# Altium project Buck_Boost_Converter.PrjPcb
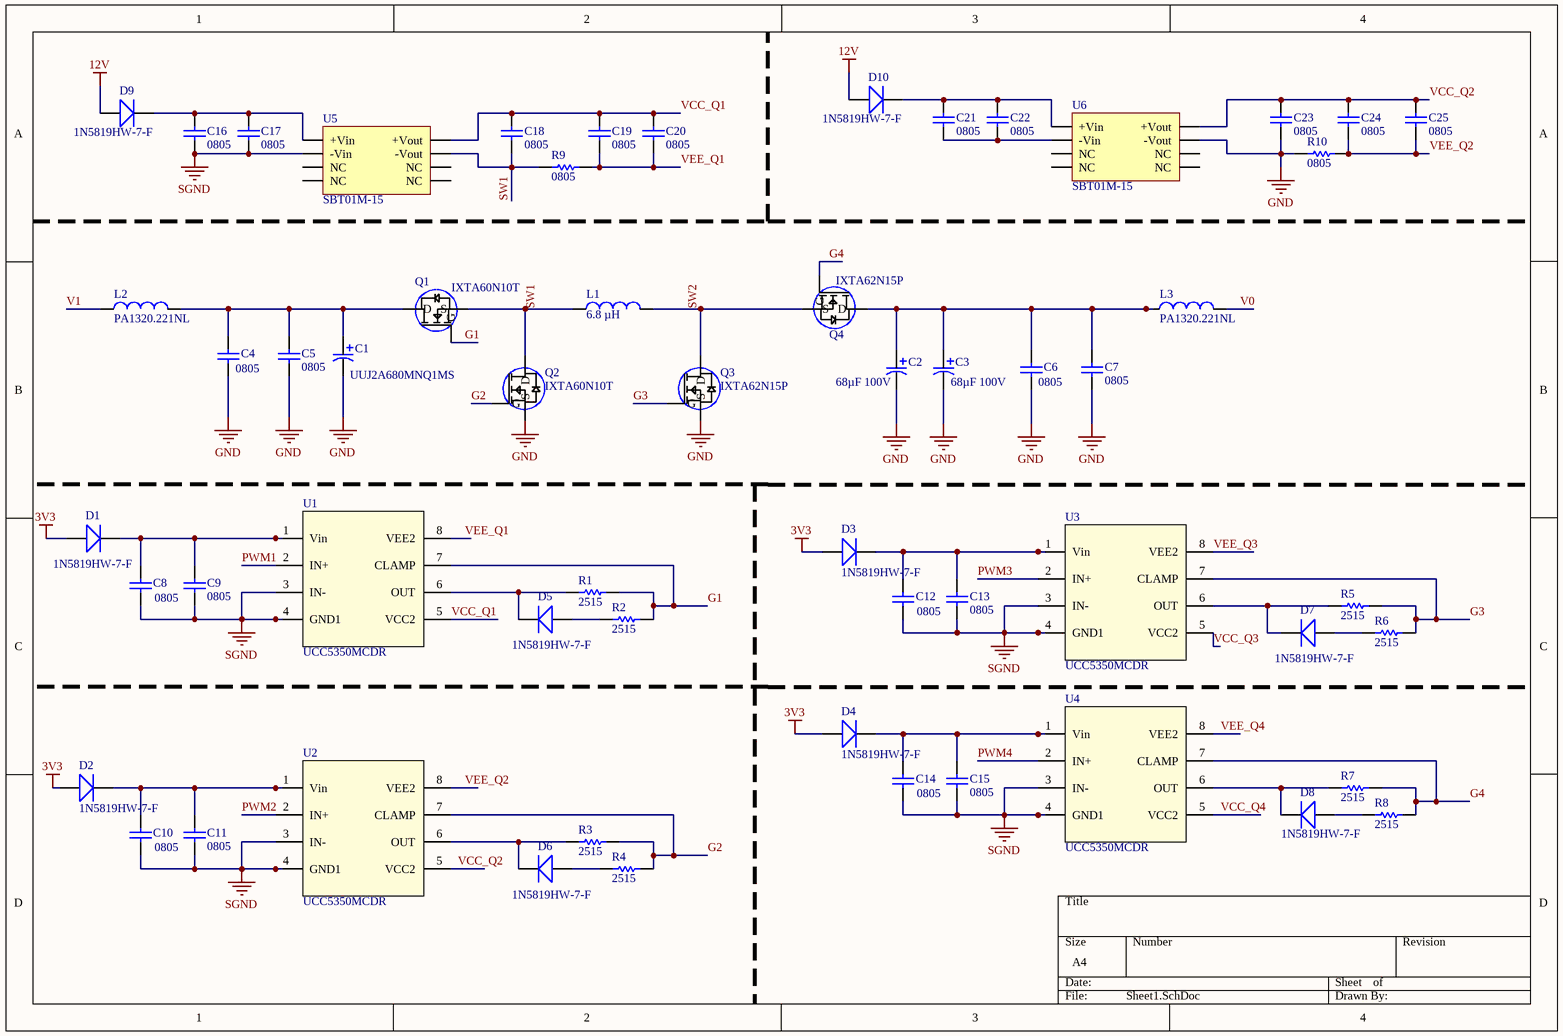
[diagram p0: Sheet1.SchDoc]
2 sheets, 100 parts. Net scope: global (net labels, ports and power ports of the same name join across sheets).
Board file: PCB1.PcbDoc
Sheets:
  Sheet1.SchDoc
  Sheet2.SchDoc

## Sheet Sheet1.SchDoc
size A4; SheetNumber: 1; SheetTotal: 2

### Parts
C1  UUJ2A680MNQ1MS  [UUJ2A680MNQ1MS]
C2  68µF 100V  [UUJ2A680MNQ1MS]
C3  68µF 100V  [UUJ2A680MNQ1MS]
C4  0805  [0805 CAPACITOR]
C5  0805  [0805 CAPACITOR]
C6  0805  [0805 CAPACITOR]
C7  0805  [0805 CAPACITOR]
C8  0805  [0805 CAPACITOR]
C9  0805  [0805 CAPACITOR]
C10  0805  [0805 CAPACITOR]
C11  0805  [0805 CAPACITOR]
C12  0805  [0805 CAPACITOR]
C13  0805  [0805 CAPACITOR]
C14  0805  [0805 CAPACITOR]
C15  0805  [0805 CAPACITOR]
C16  0805  [0805 CAPACITOR]
C17  0805  [0805 CAPACITOR]
C18  0805  [0805 CAPACITOR]
C19  0805  [0805 CAPACITOR]
C20  0805  [0805 CAPACITOR]
C21  0805  [0805 CAPACITOR]
C22  0805  [0805 CAPACITOR]
C23  0805  [0805 CAPACITOR]
C24  0805  [0805 CAPACITOR]
C25  0805  [0805 CAPACITOR]
D1  1N5819HW-7-F  [1N5819HW-7-F_DIO-M]
D2  1N5819HW-7-F  [1N5819HW-7-F_DIO-M]
D3  1N5819HW-7-F  [1N5819HW-7-F_DIO-M]
D4  1N5819HW-7-F  [1N5819HW-7-F_DIO-M]
D5  1N5819HW-7-F  [1N5819HW-7-F_DIO-M]
D6  1N5819HW-7-F  [1N5819HW-7-F_DIO-M]
D7  1N5819HW-7-F  [1N5819HW-7-F_DIO-M]
D8  1N5819HW-7-F  [1N5819HW-7-F_DIO-M]
D9  1N5819HW-7-F  [1N5819HW-7-F_DIO-M]
D10  1N5819HW-7-F  [1N5819HW-7-F_DIO-M]
L1  6.8 µH  [MPX1D2213L6R8]
L2  PA1320.221NL  [PA1320.221NL]
L3  PA1320.221NL  [PA1320.221NL]
Q1  IXTA60N10T  [IXTA62N15P]
Q2  IXTA60N10T  [IXTA62N15P]
Q3  IXTA62N15P  [IXTA62N15P]
Q4  IXTA62N15P  [IXTA62N15P]
R1  2515  [2512 RESISTOR]
R2  2515  [2512 RESISTOR]
R3  2515  [2512 RESISTOR]
R4  2515  [2512 RESISTOR]
R5  2515  [2512 RESISTOR]
R6  2515  [2512 RESISTOR]
R7  2515  [2512 RESISTOR]
R8  2515  [2512 RESISTOR]
R9  0805  [0805 RESISTOR]
R10  0805  [0805 RESISTOR]
U1  UCC5350MCDR  [UCC5350MCDR]
U2  UCC5350MCDR  [UCC5350MCDR]
U3  UCC5350MCDR  [UCC5350MCDR]
U4  UCC5350MCDR  [UCC5350MCDR]
U5  SBT01M-15  [SBT01M-15]
U6  SBT01M-15  [SBT01M-15]

### Nets
3V3: D1.1 D2.1 D3.1 D4.1
12V: D9.1 D10.1
GND: C1.2 C2.2 C3.2 C4.2 C5.1 C6.2 C7.1 C23.1 Q2.3(S) Q3.3(S) R10.1 U6.4(-Vout)
SGND: C8.1 C9.1 C10.1 C11.1 C12.1 C13.1 C14.1 C15.1 C16.2 C17.1 U1.3(IN-) U1.4(GND1) U2.3(IN-) U2.4(GND1) U3.3(IN-) U3.4(GND1) U4.3(IN-) U4.4(GND1) U5.1(-Vin)
G1: Q1.1(G) R1.2 R2.2 U1.7(CLAMP)
G2: Q2.1(G) R3.2 R4.2 U2.7(CLAMP)
G3: Q3.1(G) R5.2 R6.2 U3.7(CLAMP)
G4: Q4.1(G) R7.2 R8.2 U4.7(CLAMP)
PWM1: U1.2(IN+)
PWM2: U2.2(IN+)
PWM3: U3.2(IN+)
PWM4: U4.2(IN+)
SW1: C18.1 L1.1 Q1.3(S) Q2.2(D) R9.1 U5.4(-Vout)
SW2: L1.2 Q3.2(D) Q4.3(S)
V0: L3.2
V1: L2.1
VCC_Q1: C18.2 C19.2 C20.2 U1.5(VCC2) U5.5(+Vout)
VCC_Q2: C23.2 C24.2 C25.2 U2.5(VCC2) U6.5(+Vout)
VCC_Q3: U3.5(VCC2)
VCC_Q4: U4.5(VCC2)
VEE_Q1: C19.1 C20.1 R9.2 U1.8(VEE2)
VEE_Q2: C24.1 C25.1 R10.2 U2.8(VEE2)
VEE_Q3: U3.8(VEE2)
VEE_Q4: U4.8(VEE2)
NetC1_1: C1.1 C4.1 C5.2 L2.2 Q1.2(D)
NetC2_1: C2.1 C3.1 C6.1 C7.2 L3.1 Q4.2(D)
NetC8_2: C8.2 C9.2 D1.2 U1.1(Vin)
NetC10_2: C10.2 C11.2 D2.2 U2.1(Vin)
NetC12_2: C12.2 C13.2 D3.2 U3.1(Vin)
NetC14_2: C14.2 C15.2 D4.2 U4.1(Vin)
NetC16_1: C16.1 C17.2 D9.2 U5.2(+Vin)
NetC21_1: C21.1 C22.2 D10.2 U6.2(+Vin)
NetC21_2: C21.2 C22.1 U6.1(-Vin)
NetD5_1: D5.1 R2.1
NetD5_2: D5.2 R1.1 U1.6(OUT)
NetD6_1: D6.1 R4.1
NetD6_2: D6.2 R3.1 U2.6(OUT)
NetD7_1: D7.1 R6.1
NetD7_2: D7.2 R5.1 U3.6(OUT)
NetD8_1: D8.1 R8.1
NetD8_2: D8.2 R7.1 U4.6(OUT)

Not connected (* = marked no-connect by the designer): U5 3(NC) 6(NC) 7(NC) 8(NC); U6 3(NC) 6(NC) 7(NC) 8(NC)

### Library data of the parts
C1-C3 = UUJ2A680MNQ1MS: 68µF 100V Aluminum Electrolytic Capacitors
C4 C6 = 0805CAP: 1UF 100V CAP CER  X7S 0805
C5 C7 = 0805CAP_1: 0.1UF 100V CAP CER X5R 0402
C8-C25 = 0805 CAPACITANCE: 4.7UF 100V CAP CER  X7S 0805
D1-D10 = 1N5819HW-7-F: 40V 1A DIODE SCHOTTKY
L1 = 6.8 µH Shielded Wirewound Inductor: 6.8UH 39A 3.3 MOHM SMD
Q1 Q2 = IXTA60N10T: N-Channel 100 V 60A (Tc) 176W (Tc) Surface Mount TO-263AA
Q3 Q4 = IXTA62N15P: N-Channel 150 V 62A (Tc) 350W (Tc) Surface Mount TO-263AA
R1-R8 = 2515 RESISTOR: 10 OHM RES SMD 10 OHM 5% 1W 2512
R9 R10 = 0805 RESISTOR: 1K OHM 16V
U1-U4 = UCC5350MCDR: No Description Available

## Sheet Sheet2.SchDoc
size A4; SheetNumber: 2; SheetTotal: 2
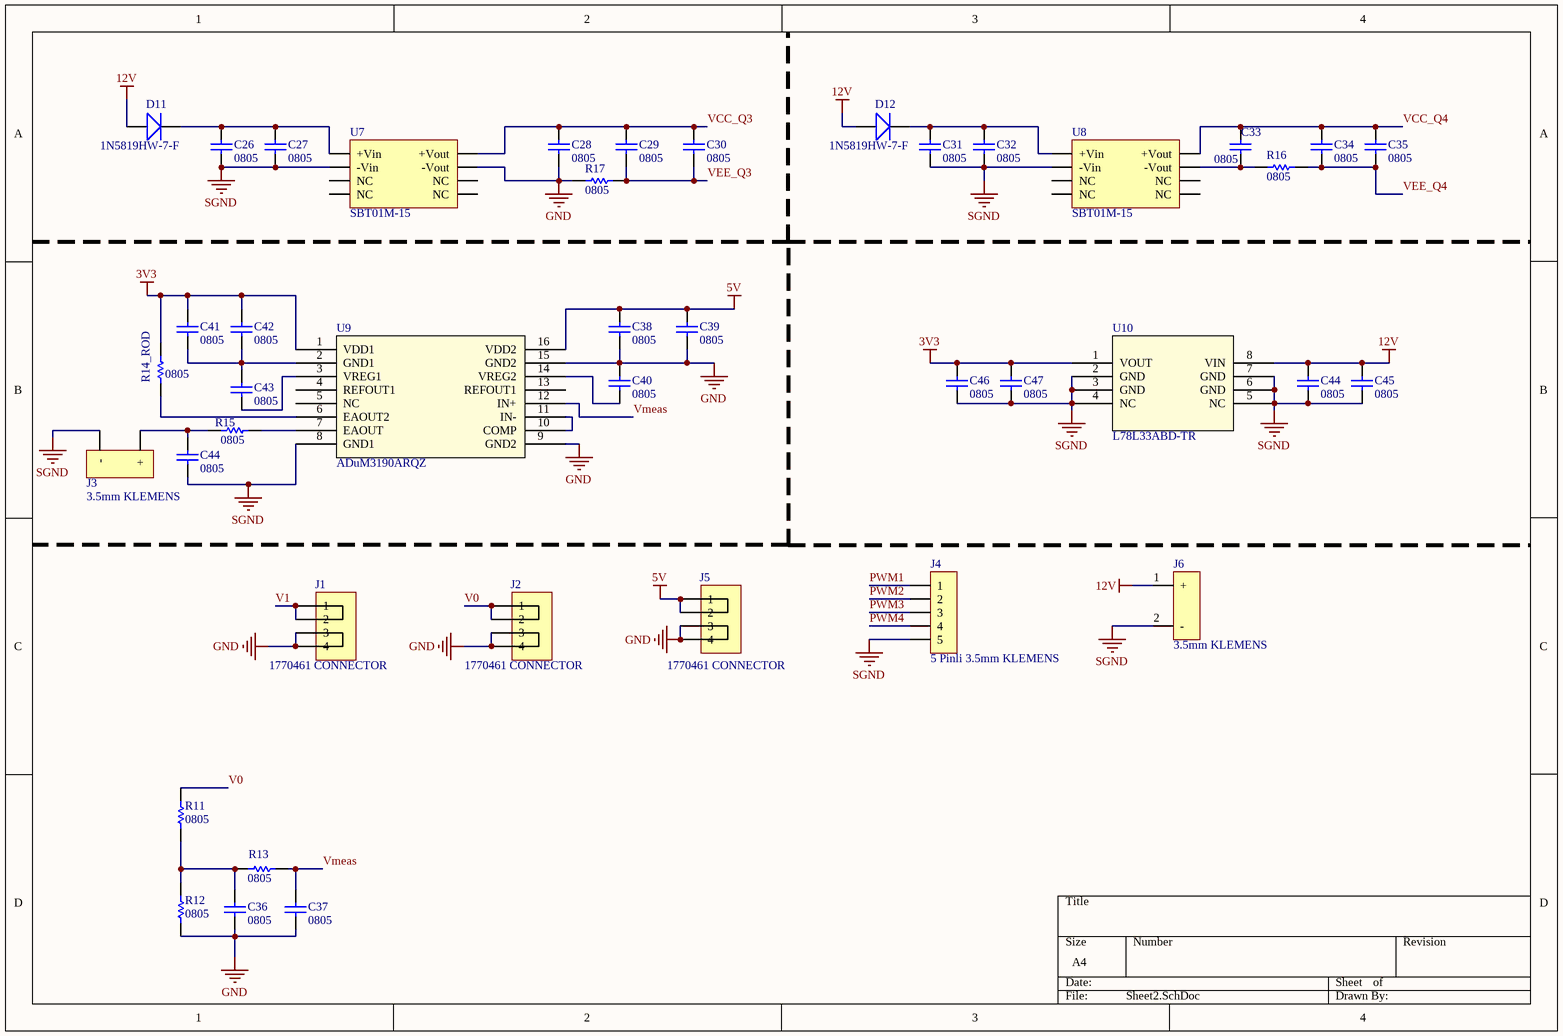
[diagram p1: Sheet2.SchDoc]

### Parts
(Parts that share a designator on the sheet are numbered #1, #2 ... from top to bottom, then left to right.)
C26  0805  [0805 CAPACITOR]
C27  0805  [0805 CAPACITOR]
C28  0805  [0805 CAPACITOR]
C29  0805  [0805 CAPACITOR]
C30  0805  [0805 CAPACITOR]
C31  0805  [0805 CAPACITOR]
C32  0805  [0805 CAPACITOR]
C33  0805  [0805 CAPACITOR]
C34  0805  [0805 CAPACITOR]
C35  0805  [0805 CAPACITOR]
C36  0805  [0805 CAPACITOR]
C37  0805  [0805 CAPACITOR]
C38  0805  [0805 CAPACITOR]
C39  0805  [0805 CAPACITOR]
C40  0805  [0805 CAPACITOR]
C41  0805  [0805 CAPACITOR]
C42  0805  [0805 CAPACITOR]
C43  0805  [0805 CAPACITOR]
C44#1  0805  [0805 CAPACITOR]
C44#2  0805  [0805 CAPACITOR]
C45  0805  [0805 CAPACITOR]
C46  0805  [0805 CAPACITOR]
C47  0805  [0805 CAPACITOR]
D11  1N5819HW-7-F  [1N5819HW-7-F_DIO-M]
D12  1N5819HW-7-F  [1N5819HW-7-F_DIO-M]
J1  1770461 CONNECTOR  [CONN_1770461]
J2  1770461 CONNECTOR  [CONN_1770461]
J3  3.5mm KLEMENS  [3PIN 3.5mm KLEMENS]
J4  5 Pinli 3.5mm KLEMENS  [5PIN 35.MM KLEMENS]
J5  1770461 CONNECTOR  [CONN_1770461]
J6  3.5mm KLEMENS  [3PIN 3.5mm KLEMENS]
R11  0805  [0805 RESISTOR]
R12  0805  [0805 RESISTOR]
R13  0805  [0805 RESISTOR]
R14_ROD  0805  [0805 RESISTOR]
R15  0805  [0805 RESISTOR]
R16  0805  [0805 RESISTOR]
R17  0805  [0805 RESISTOR]
U7  SBT01M-15  [SBT01M-15]
U8  SBT01M-15  [SBT01M-15]
U9  ADuM3190ARQZ  [ADuM3190ARQZ]
U10  L78L33ABD-TR  [L78L33ABD-TR]

### Nets
3V3: C41.2 C42.2 C46.2 C47.2 R14_ROD.2 U9.1(VDD1) U10.1(VOUT)
5V: C38.2 C39.2 J5.1 J5.2 U9.16(VDD2)
12V: C44#1.2 C45.2 D11.1 D12.1 J6.1(+) U10.8(VIN)
GND: C28.1 C36.1 C37.1 C38.1 C39.1 C40.2 J1.3 J1.4 J2.3 J2.4 J5.3 J5.4 R12.2 R17.1 U7.4(-Vout) U9.9(GND2) U9.15(GND2)
SGND: C26.2 C27.1 C31.1 C32.1 C44#1.1 C44#2.1 C45.1 C46.1 C47.1 J3.2(-) J4.5 J6.2(-) U7.1(-Vin) U8.1(-Vin) U9.8(GND1) U10.2(GND) U10.3(GND) U10.4(NC) U10.5(NC) U10.6(GND) U10.7(GND)
PWM1: J4.1
PWM2: J4.2
PWM3: J4.3
PWM4: J4.4
V0: J2.1 J2.2 R11.1
V1: J1.1 J1.2
VCC_Q3: C28.2 C29.2 C30.2 U7.5(+Vout)
VCC_Q4: C33.2 C34.2 C35.2 U8.5(+Vout)
VEE_Q3: C29.1 C30.1 R17.2
VEE_Q4: C34.1 C35.1 R16.2
Vmeas: C37.2 R13.1 U9.12(IN+)
NetC26_1: C26.1 C27.2 D11.2 U7.2(+Vin)
NetC31_2: C31.2 C32.2 D12.2 U8.2(+Vin)
NetC33_1: C33.1 R16.1 U8.4(-Vout)
NetC36_2: C36.2 R11.2 R12.1 R13.2
NetC40_1: C40.1 U9.14(VREG2)
NetC41_1: C41.1 C42.1 C43.2 U9.2(GND1)
NetC43_1: C43.1 U9.3(VREG1)
NetC44#2_2: C44#2.2 J3.1(+) R15.1
NetR14_ROD_1: R14_ROD.1 U9.6(EAOUT2)
NetR15_2: R15.2 U9.7(EAOUT)
NetU9_10: U9.10(COMP) U9.11(IN-)

Not connected (* = marked no-connect by the designer): U7 3(NC) 6(NC) 7(NC) 8(NC); U8 3(NC) 6(NC) 7(NC) 8(NC); U9 4(REFOUT1) 5(NC) 13(REFOUT1)

### Library data of the parts
C26-C37 = 0805 CAPACITANCE: 4.7UF 100V CAP CER  X7S 0805
C38-C43 C44#1 C44#2 C45-C47 = 0805CAP_1: 0.1UF 100V CAP CER X5R 0402
D11 D12 = 1N5819HW-7-F: 40V 1A DIODE SCHOTTKY
J1 J2 J5 = 1770461 CONNECTOR: TERM BLK 2P SIDE ENTRY
R11-R13 R14_ROD R15-R17 = 0805 RESISTOR: 1K OHM 16V
U9 = ADuM3190ARQZ: IC ISOLATOR 16QSOP
U10 = L78L33ABD-TR: IC REG LINEAR 3.3V 100MA 8SO

## Nets that join several sheets
3V3: Sheet1 (D1.1 D2.1 D3.1 D4.1), Sheet2 (7 pins)
12V: Sheet1 (D9.1 D10.1), Sheet2 (6 pins)
GND: Sheet1 (12 pins), Sheet2 (17 pins)
SGND: Sheet1 (19 pins), Sheet2 (21 pins)
PWM1: Sheet1 (U1.2), Sheet2 (J4.1)
PWM2: Sheet1 (U2.2), Sheet2 (J4.2)
PWM3: Sheet1 (U3.2), Sheet2 (J4.3)
PWM4: Sheet1 (U4.2), Sheet2 (J4.4)
V0: Sheet1 (L3.2), Sheet2 (J2.1 J2.2 R11.1)
V1: Sheet1 (L2.1), Sheet2 (J1.1 J1.2)
VCC_Q3: Sheet1 (U3.5), Sheet2 (C28.2 C29.2 C30.2 U7.5)
VCC_Q4: Sheet1 (U4.5), Sheet2 (C33.2 C34.2 C35.2 U8.5)
VEE_Q3: Sheet1 (U3.8), Sheet2 (C29.1 C30.1 R17.2)
VEE_Q4: Sheet1 (U4.8), Sheet2 (C34.1 C35.1 R16.2)